# Altium schematic sheet 3.3VDC Powersupply.SchDoc: 3.3VDC Powersupply
size Letter; Date: 2017-02-10; DocumentNumber: 9; Revision: A; SheetNumber: 9; SheetTotal: 16; DesignedBy: Craig Comberbach
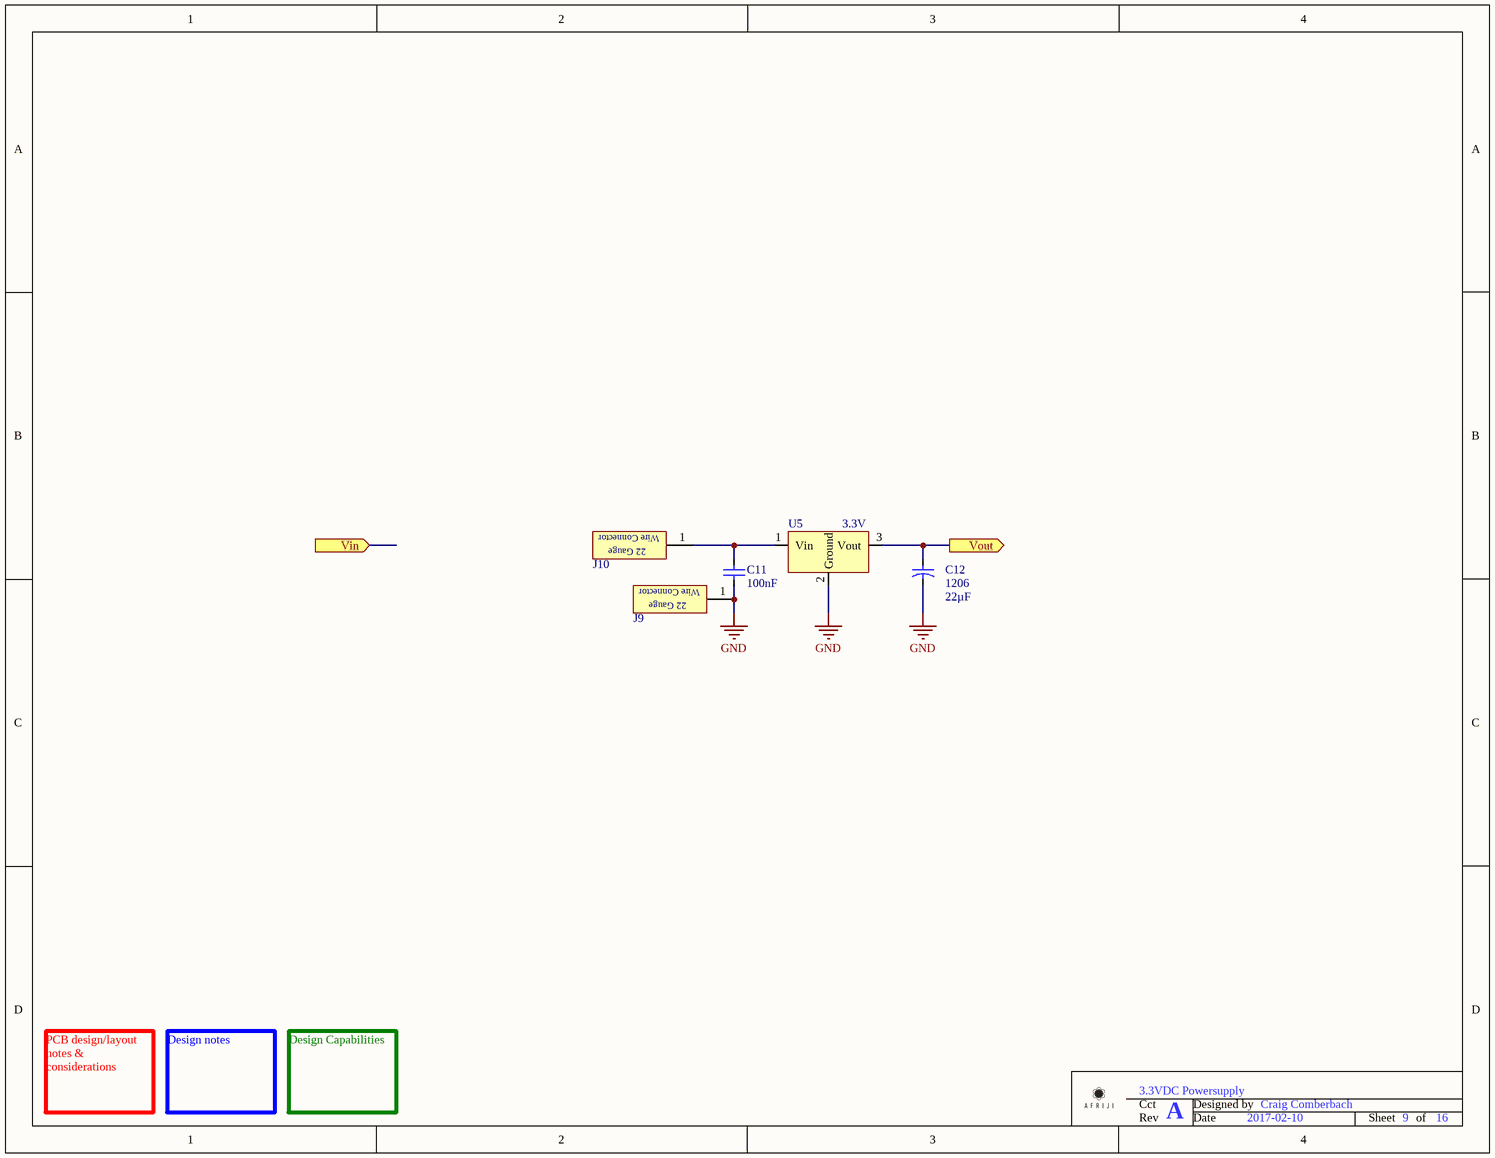
[diagram p0: 3.3VDC Powersupply.SchDoc]

## Parts
C11  Capacitance: 100nF  [Capacitor - 0603 Ceramic]  (hidden comment: 100nF 0603 50V)
C12  1206  Capacitance: 22µF  [Capacitor - 1210 Tantalum]
J9  GND  [1 Pin 22-Gauge Wire Connector]  (value not drawn)  (no BOM)
J10  3.3VDC  [1 Pin 22-Gauge Wire Connector]  (value not drawn)  (no BOM)
U5  Voltage - Output: 3.3V  [SOT223]  (hidden comment: 3.3V Linear Voltage Regulator LDO)

## Ports
Vin (in), Vout (out)

## Nets
GND: C11.2 C12.2 J9.1 U5.2(Ground)
Vout: C12.1 U5.3(Vout) ; port Vout
NetC11_1: C11.1 J10.1 U5.1(Vin)

## Notes on the sheet
- PCB design/layout notes & considerations
- Design notes
- Design Capabilities
- Cct
- Designed by
- Rev
- Date
- Sheet
- of
- (in symbol 1 Pin 22-Gauge Wire connector) Wire Connector; 22 Gauge

## Library data of the parts
C11 = 100nF 0603 50V: Non-polarized; Manufacturer: Murata Electronics North America; Manufacturer Part Number: GRM188R71H104KA93D; Value: 100 nF 50V 0603 XR7 10%; Tolerance: ±10%; Temperature Coefficient: X7R; Technology: SMT; Supplier 1: Digi-Key; Supplier Part Number 1: 490-1519-1-ND; RoHS: RoHS Compliant; Category: Capacitors; Stock 1: 4132110; Pricing 1: 1=0.12, 10=0.048, 50=0.0256, 100=0.0218, 250=0.01776, 500=0.0152, 1000=0.01185 (CAD); Packaging: Cut Tape (CT); Voltage - Rated: 50V; Mounting Type: Surface Mount, MLCC; Operating Temperature: -55°C ~ 125°C; Applications: General Purpose; Ratings: -; Package / Case: 0603 (1608 Metric); Size / Dimension: 0.063" L x 0.031" W (1.60mm x 0.80mm); Height - Seated (Max): -; Thickness (Max): 0.035" (0.90mm); Lead Spacing: -; Features: -; Lead Style: -; ComponentLink1URL: http://www.murata.com/products/catalog/pdf/c02e.pdf; ComponentLink1Description: Spec Sheet
C12 = 22uF 1210 10V - Tantalum: Polarized; Manufacturer: AVX Corporation; Manufacturer Part Number: TAJB226K010RNJ; Manufacturer Size Code: B; Value: 22 uF 10V 1210 Tantalum; Tolerance: ±10%; Voltage - Rated: 10V; ESR (Equivalent Series Resistance): 2.4 Ohm; Type: Molded; Technology: SMT; Supplier 1: Digi-Key; Supplier Part Number 1: 478-3039-1-ND; RoHS: RoHS Compliant; Category: Capacitors; Stock 1: 9403; Pricing 1: 1=0.92, 10=0.882, 100=0.428, 250=0.35556, 500=0.32264, 1000=0.29629 (CAD); Packaging: Cut Tape (CT); Operating Temperature: -55°C ~ 125°C; Mounting Type: Surface Mount; Package / Case: 1210 (3528 Metric); Size / Dimension: 0.138" L x 0.110" W (3.50mm x 2.80mm); Height - Seated (Max): 0.083" (2.10mm); Lead Spacing: -; Features: General Purpose; Lifetime @ Temp.: -; ComponentLink1URL: http://www.avx.com/docs/Catalogs/taj.pdf; ComponentLink1Description: Spec Sheet
J9 J10 = 1 Pin 22-Gauge Wire connector
U5 = 3.3V Linear Voltage Regulator LDO: 500mA; Manufacturer: Micrel Inc; Manufacturer Part Number: MIC5209-3.3YS TR; Regulator Topology: Positive Fixed; Voltage - Dropout (Typical): 0.35V @ 500mA; Number of Regulators: 1; Voltage - Input: Up to 16V; Technology: SMT; Value: 3.3V Linear Voltage Regulator LDO; Supplier 1: Digi-Key; Supplier Part Number 1: 576-1274-1-ND; RoHS: RoHS Compliant; Category: Integrated Circuits (ICs); Stock 1: 13773; Pricing 1: 1=2.1, 10=1.871, 25=1.6516, 100=1.4864, 250=1.29364, 500=1.15602, 1000=0.9083 (CAD); Packaging: Cut Tape (CT); Current - Output: 500mA; Current - Limit (Min): -; Operating Temperature: -40°C ~ 125°C; Mounting Type: Surface Mount; Package / Case: TO-261-4, TO-261AA; Supplier Device Package: SOT-223; ComponentLink1URL: http://www.micrel.com/_PDF/mic5209.pdf; ComponentLink1Description: Spec Sheet